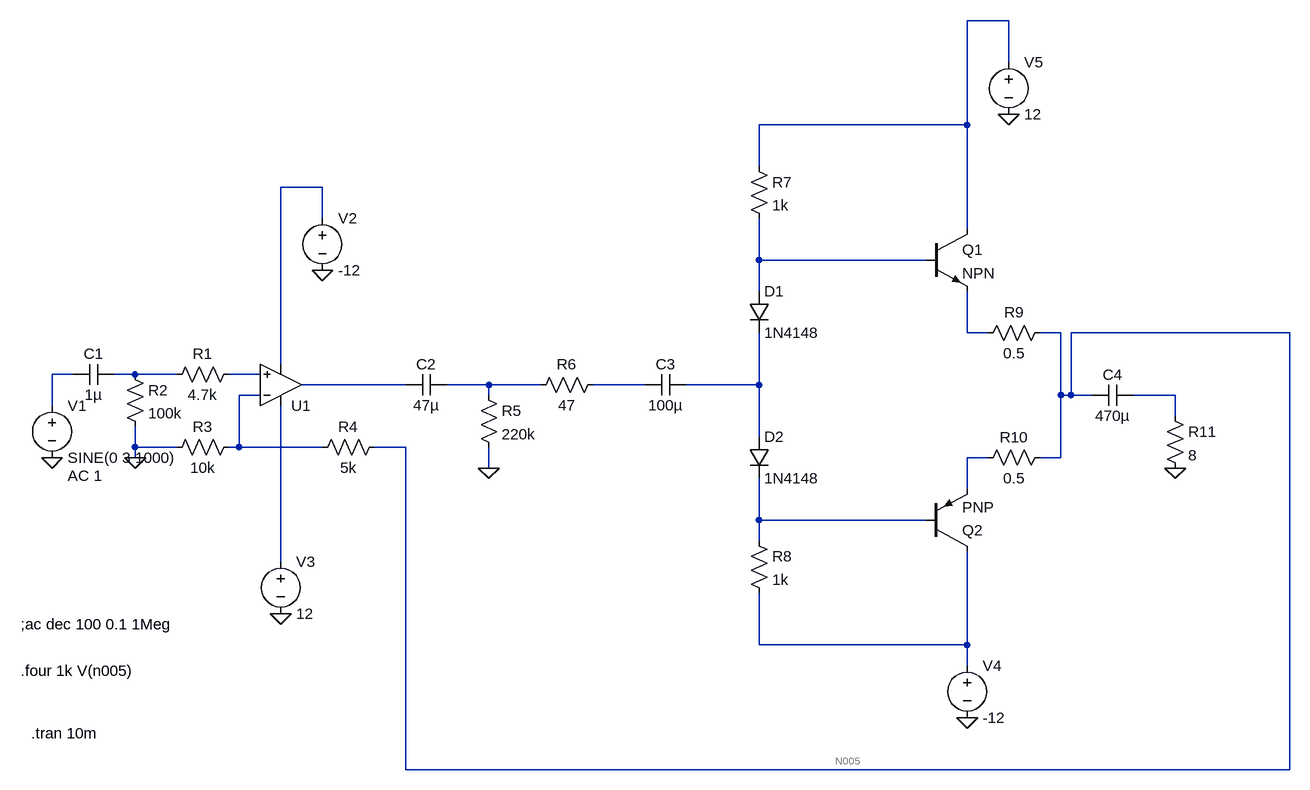
[diagram p0: schematic AUDIO_AMPLIFIER_CIRCUIT.asc]
AUDIO_AMPLIFIER_CIRCUIT.asc, the LTspice schematic file:
Version 4
SHEET 1 1780 772
WIRE 1344 -384 1280 -384
WIRE 1344 -320 1344 -384
WIRE 1280 -224 1280 -384
WIRE 1280 -224 960 -224
WIRE 960 -160 960 -224
WIRE 288 -128 224 -128
WIRE 288 -80 288 -128
WIRE 1280 -64 1280 -224
WIRE 960 -16 960 -80
WIRE 1216 -16 960 -16
WIRE 960 32 960 -16
WIRE 1280 96 1280 32
WIRE 1312 96 1280 96
WIRE 1424 96 1392 96
WIRE 1776 96 1440 96
WIRE 224 144 224 -128
WIRE -96 160 -128 160
WIRE 0 160 -32 160
WIRE 64 160 0 160
WIRE 192 160 144 160
WIRE 416 176 256 176
WIRE 544 176 480 176
WIRE 624 176 544 176
WIRE 784 176 704 176
WIRE 960 176 960 96
WIRE 960 176 848 176
WIRE 192 192 160 192
WIRE 544 192 544 176
WIRE 1424 192 1424 96
WIRE 1440 192 1440 96
WIRE 1440 192 1424 192
WIRE 1472 192 1440 192
WIRE 1600 192 1536 192
WIRE -128 208 -128 160
WIRE 1600 224 1600 192
WIRE 960 256 960 176
WIRE 0 272 0 240
WIRE 64 272 0 272
WIRE 160 272 160 192
WIRE 160 272 144 272
WIRE 288 272 160 272
WIRE 416 272 368 272
WIRE 0 288 0 272
WIRE 1312 288 1280 288
WIRE 1424 288 1424 192
WIRE 1424 288 1392 288
WIRE 544 304 544 272
WIRE 1280 336 1280 288
WIRE 960 384 960 320
WIRE 1216 384 960 384
WIRE 960 416 960 384
WIRE 224 448 224 208
WIRE 960 576 960 496
WIRE 1280 576 1280 432
WIRE 1280 576 960 576
WIRE 1280 608 1280 576
WIRE 416 768 416 272
WIRE 1776 768 1776 96
WIRE 1776 768 416 768
FLAG 0 288 0
FLAG -128 288 0
FLAG 224 528 0
FLAG 288 0 0
FLAG 544 304 0
FLAG 1600 304 0
FLAG 1280 688 0
FLAG 1344 -240 0
SYMBOL voltage -128 192 R0
WINDOW 123 24 124 Left 2
WINDOW 39 0 0 Left 0
SYMATTR Value2 AC 1
SYMATTR InstName V1
SYMATTR Value SINE(0 3 1000)
SYMBOL cap -96 176 R270
WINDOW 0 32 32 VTop 2
WINDOW 3 0 32 VBottom 2
SYMATTR InstName C1
SYMATTR Value 1µ
SYMBOL res 48 176 R270
WINDOW 0 32 56 VTop 2
WINDOW 3 0 56 VBottom 2
SYMATTR InstName R1
SYMATTR Value 4.7k
SYMBOL res -16 144 R0
SYMATTR InstName R2
SYMATTR Value 100k
SYMBOL res 48 288 R270
WINDOW 0 32 56 VTop 2
WINDOW 3 0 56 VBottom 2
SYMATTR InstName R3
SYMATTR Value 10k
SYMBOL OpAmps\\UniversalOpAmp2 224 176 M180
SYMATTR InstName U1
SYMBOL res 272 288 R270
WINDOW 0 32 56 VTop 2
WINDOW 3 0 56 VBottom 2
SYMATTR InstName R4
SYMATTR Value 5k
SYMBOL cap 416 192 R270
WINDOW 0 32 32 VTop 2
WINDOW 3 0 32 VBottom 2
SYMATTR InstName C2
SYMATTR Value 47µ
SYMBOL res 528 176 R0
SYMATTR InstName R5
SYMATTR Value 220k
SYMBOL res 608 192 R270
WINDOW 0 32 56 VTop 2
WINDOW 3 0 56 VBottom 2
SYMATTR InstName R6
SYMATTR Value 47
SYMBOL cap 784 192 R270
WINDOW 0 32 32 VTop 2
WINDOW 3 0 32 VBottom 2
SYMATTR InstName C3
SYMATTR Value 100µ
SYMBOL diode 944 32 R0
SYMATTR InstName D1
SYMATTR Value 1N4148
SYMBOL diode 944 256 R0
SYMATTR InstName D2
SYMATTR Value 1N4148
SYMBOL res 944 -176 R0
SYMATTR InstName R7
SYMATTR Value 1k
SYMBOL res 944 400 R0
SYMATTR InstName R8
SYMATTR Value 1k
SYMBOL npn 1216 -64 R0
SYMATTR InstName Q1
SYMBOL pnp 1216 432 M180
SYMATTR InstName Q2
SYMBOL res 1296 112 R270
WINDOW 0 32 56 VTop 2
WINDOW 3 0 56 VBottom 2
SYMATTR InstName R9
SYMATTR Value 0.5
SYMBOL res 1296 304 R270
WINDOW 0 32 56 VTop 2
WINDOW 3 0 56 VBottom 2
SYMATTR InstName R10
SYMATTR Value 0.5
SYMBOL cap 1472 208 R270
WINDOW 0 32 32 VTop 2
WINDOW 3 0 32 VBottom 2
SYMATTR InstName C4
SYMATTR Value 470µ
SYMBOL res 1584 208 R0
SYMATTR InstName R11
SYMATTR Value 8
SYMBOL voltage 288 -96 R0
SYMATTR InstName V2
SYMATTR Value -12
SYMBOL voltage 224 432 R0
SYMATTR InstName V3
SYMATTR Value 12
SYMBOL voltage 1280 592 R0
WINDOW 123 0 0 Left 0
WINDOW 39 0 0 Left 0
SYMATTR InstName V4
SYMATTR Value -12
SYMBOL voltage 1344 -336 R0
WINDOW 123 0 0 Left 0
WINDOW 39 0 0 Left 0
SYMATTR InstName V5
SYMATTR Value 12
TEXT -160 712 Left 2 !.tran 10m
TEXT -176 616 Left 2 !.four 1k V(n005)
TEXT -176 544 Left 2 !;ac dec 100 0.1 1Meg

The netlist it stands for:
* AUDIO_AMPLIFIER_CIRCUIT.asc
V1 N006 0 SINE(0 3 1000) AC 1
C1 N006 N007 1µ
R1 N007 N008 4.7k
R2 N007 0 100k
R3 0 N013 10k
XU1 N008 N013 N017 N002 N009 level2 Avol=1Meg GBW=10Meg Slew=10Meg Ilimit=25m Rail=0 Vos=0 En=0 Enk=0 In=0 Ink=0 Rin=500Meg  ; pins In+ In- V+ V- OUT
R4 N013 N005 5k
C2 N009 N010 47µ
R5 N010 0 220k
R6 N010 N011 47
C3 N011 N012 100µ
D1 N003 N012 1N4148
D2 N012 N016 1N4148
R7 N001 N003 1k
R8 N016 N018 1k
Q1 N001 N003 N004 0 NPN
Q2 N018 N016 N015 0 PNP
R9 N004 N005 0.5
R10 N015 N005 0.5
C4 N005 N014 470µ
R11 N014 0 8
V2 N002 0 -12
V3 N017 0 12
V4 N018 0 -12
V5 N001 0 12
.model D D
.lib standard.dio
.model NPN NPN
.model PNP PNP
.lib standard.bjt
.tran 10m
.four 1k V(n005)
;ac dec 100 0.1 1Meg
.lib UniversalOpAmp2.lib
.backanno
.end